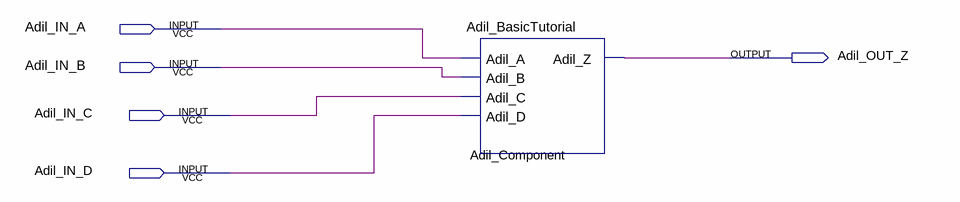
[diagram p0: schematic sheet]
// Quartus schematic Adil_BasicSymbol.bdf as structural Verilog: 1 symbols, 5 pins
module Adil_BasicSymbol (
  input  Adil_IN_A,
  input  Adil_IN_B,
  input  Adil_IN_C,
  input  Adil_IN_D,
  output Adil_OUT_Z
);

  Adil_BasicTutorial Adil_Component (
    .Adil_A(Adil_IN_A), .Adil_B(Adil_IN_B), .Adil_C(Adil_IN_C), .Adil_D(Adil_IN_D), .Adil_Z(Adil_OUT_Z));
endmodule
